# EAGLE design DSC-Supply (EAGLE 7.7.0)
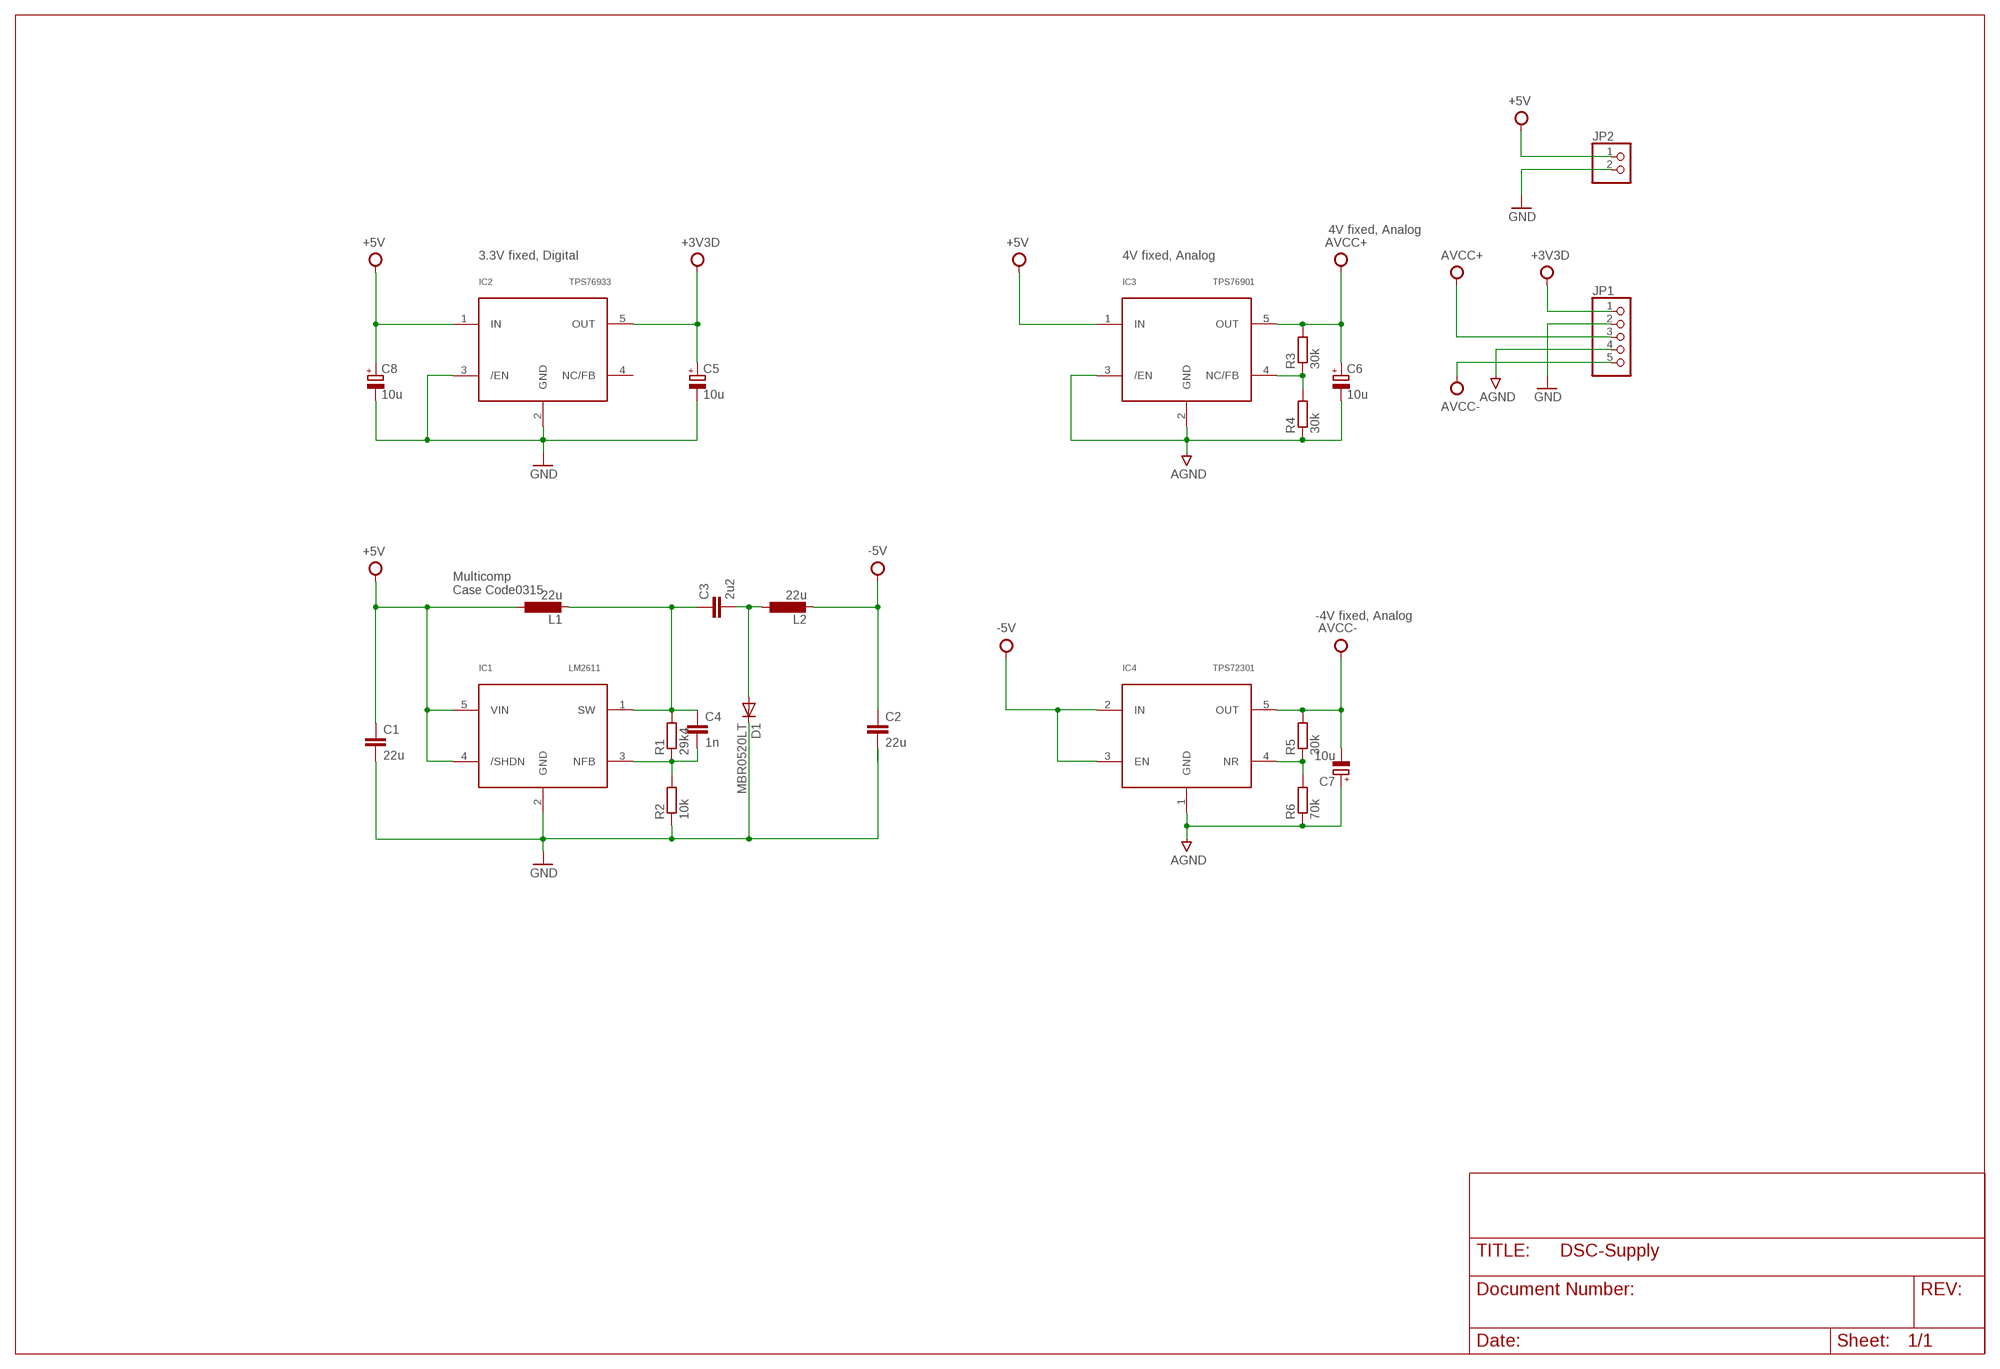
[diagram p0: schematic, sheet 1]

## Parts
C1  22u  C-EUC0805  [C0805]
C2  22u  C-EUC0805  [C0805]
C3  2u2  C-EUC0805  [C0805]
C4  1n  C-EUC0805  [C0805]
C5  10u  CPOL-EU153CLV-0405  [153CLV-0405]
C6  10u  CPOL-EU153CLV-0405  [153CLV-0405]
C7  10u  CPOL-EU153CLV-0405  [153CLV-0405]
C8  10u  CPOL-EU153CLV-0405  [153CLV-0405]
D1  MBR0520LT  [SOD123]
IC1  LM2611  [SOT23-DBV]
IC2  TPS76933  TPS769XX  [SOT23-DBV]
IC3  TPS76901  TPS769XX  [SOT23-DBV]
IC4  TPS72301  [SOT23-DBV]
JP1  PINHD-1X5  [1X05]
JP2  PINHD-1X2  [1X02]
L1  22u  L-EU  [L0315]
L2  22u  L-EU  [L0315]
R1  29k4  R-EU_R0805  [R0805]
R2  10k  R-EU_R0805  [R0805]
R3  30k  R-EU_R0805  [R0805]
R4  30k  R-EU_R0805  [R0805]
R5  30k  R-EU_R0805  [R0805]
R6  70k  R-EU_R0805  [R0805]

## Nets
+3V3D: C5.+ IC2.5(OUT) JP1.1
+5V: C1.1 C8.+ IC1.4(/SHDN) IC1.5(VIN) IC2.1(IN) IC3.1(IN) JP2.1 L1.1
-5V: C2.1 IC4.2(IN) IC4.3(EN) L2.2
AGND: C6.- C7.+ IC3.2(GND) IC3.3(/EN) IC4.1(GND) JP1.4 R4.1 R6.1
AVCC+: C6.+ IC3.5(OUT) JP1.3 R3.2
AVCC-: C7.- IC4.5(OUT) JP1.5 R5.2
GND: C1.2 C2.2 C5.- C8.- D1.C IC1.2(GND) IC2.2(GND) IC2.3(/EN) JP1.2 JP2.2 R2.1
N$2: C3.1 C4.1 IC1.1(SW) L1.2 R1.2
N$3: C4.2 IC1.3(NFB) R1.1 R2.2
N$4: IC3.4(NC/FB) R3.1 R4.2
N$6: IC4.4(NR) R5.1 R6.2
N$8: C3.2 D1.A L2.1
Unconnected: IC2.4(NC/FB)

## Notes on the sheet
- 4V fixed, Analog
- 3.3V fixed, Digital | 4V fixed, Analog
- Multicomp 
  Case Code0315
- -4V fixed, Analog

## Library data of the parts
C1-C4 = rcl-2:C-EU: CAPACITOR, European symbol
C5-C8 = rcl-2:CPOL-EU: POLARIZED CAPACITOR, European symbol
D1 = diode:MBR0520LT: SCHOTTKY BARRIER RECTIFIER Source: http://onsemi.com .. MBR0520LT1-D.pdf
IC1 = SupplySolutions:LM2611
IC2 IC3 = SupplySolutions:TPS769XX
IC4 = SupplySolutions:TPS72301
JP1 = pinhead:PINHD-1X5: PIN HEADER
JP2 = pinhead:PINHD-1X2: PIN HEADER
L1 L2 = sty_resistor:L-EU: INDUCTOR, European symbol
R1-R6 = rcl-2:R-EU_: RESISTOR, European symbol

## Board
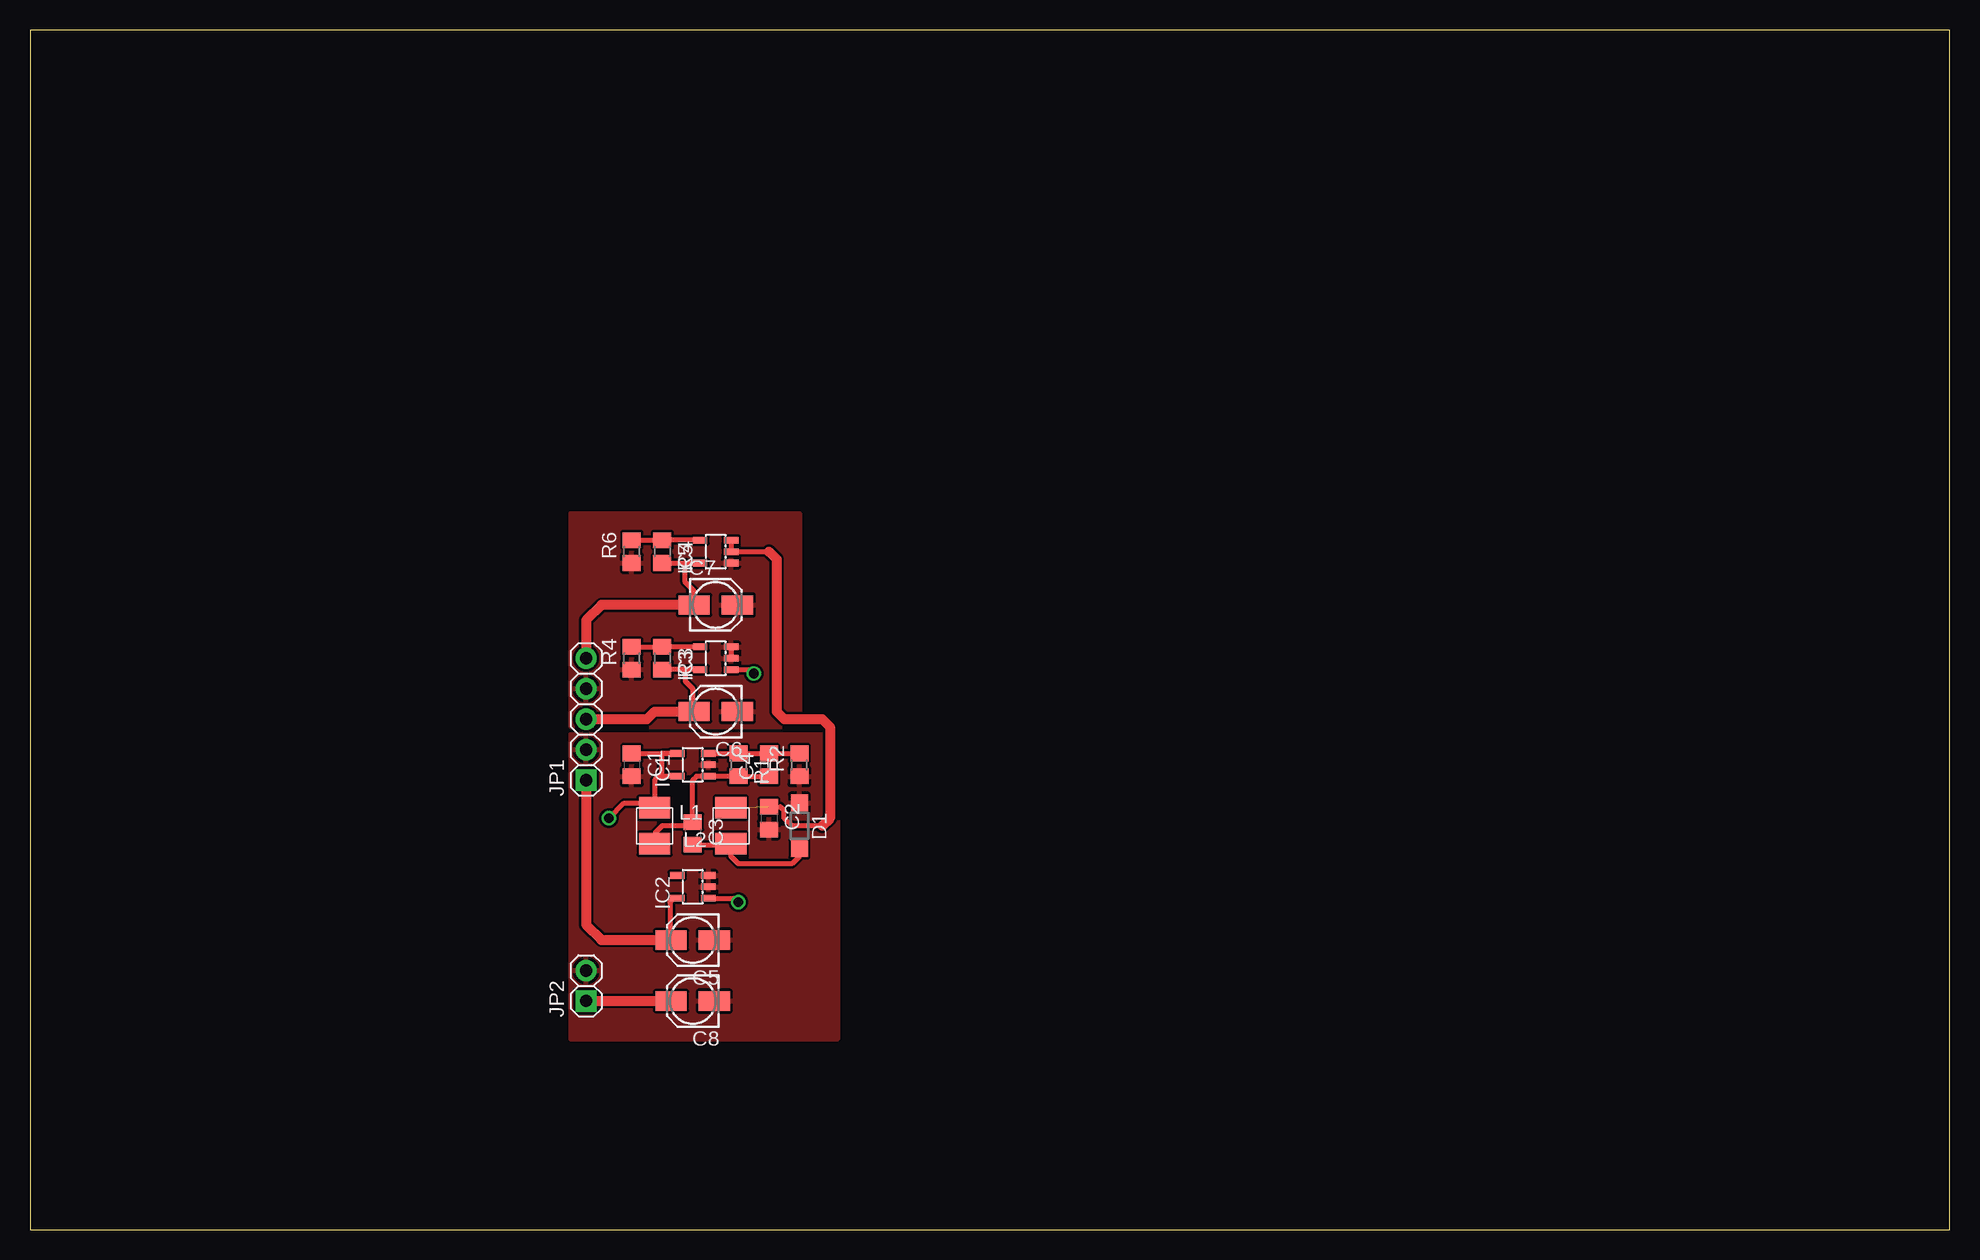
[diagram p1: board, top side]
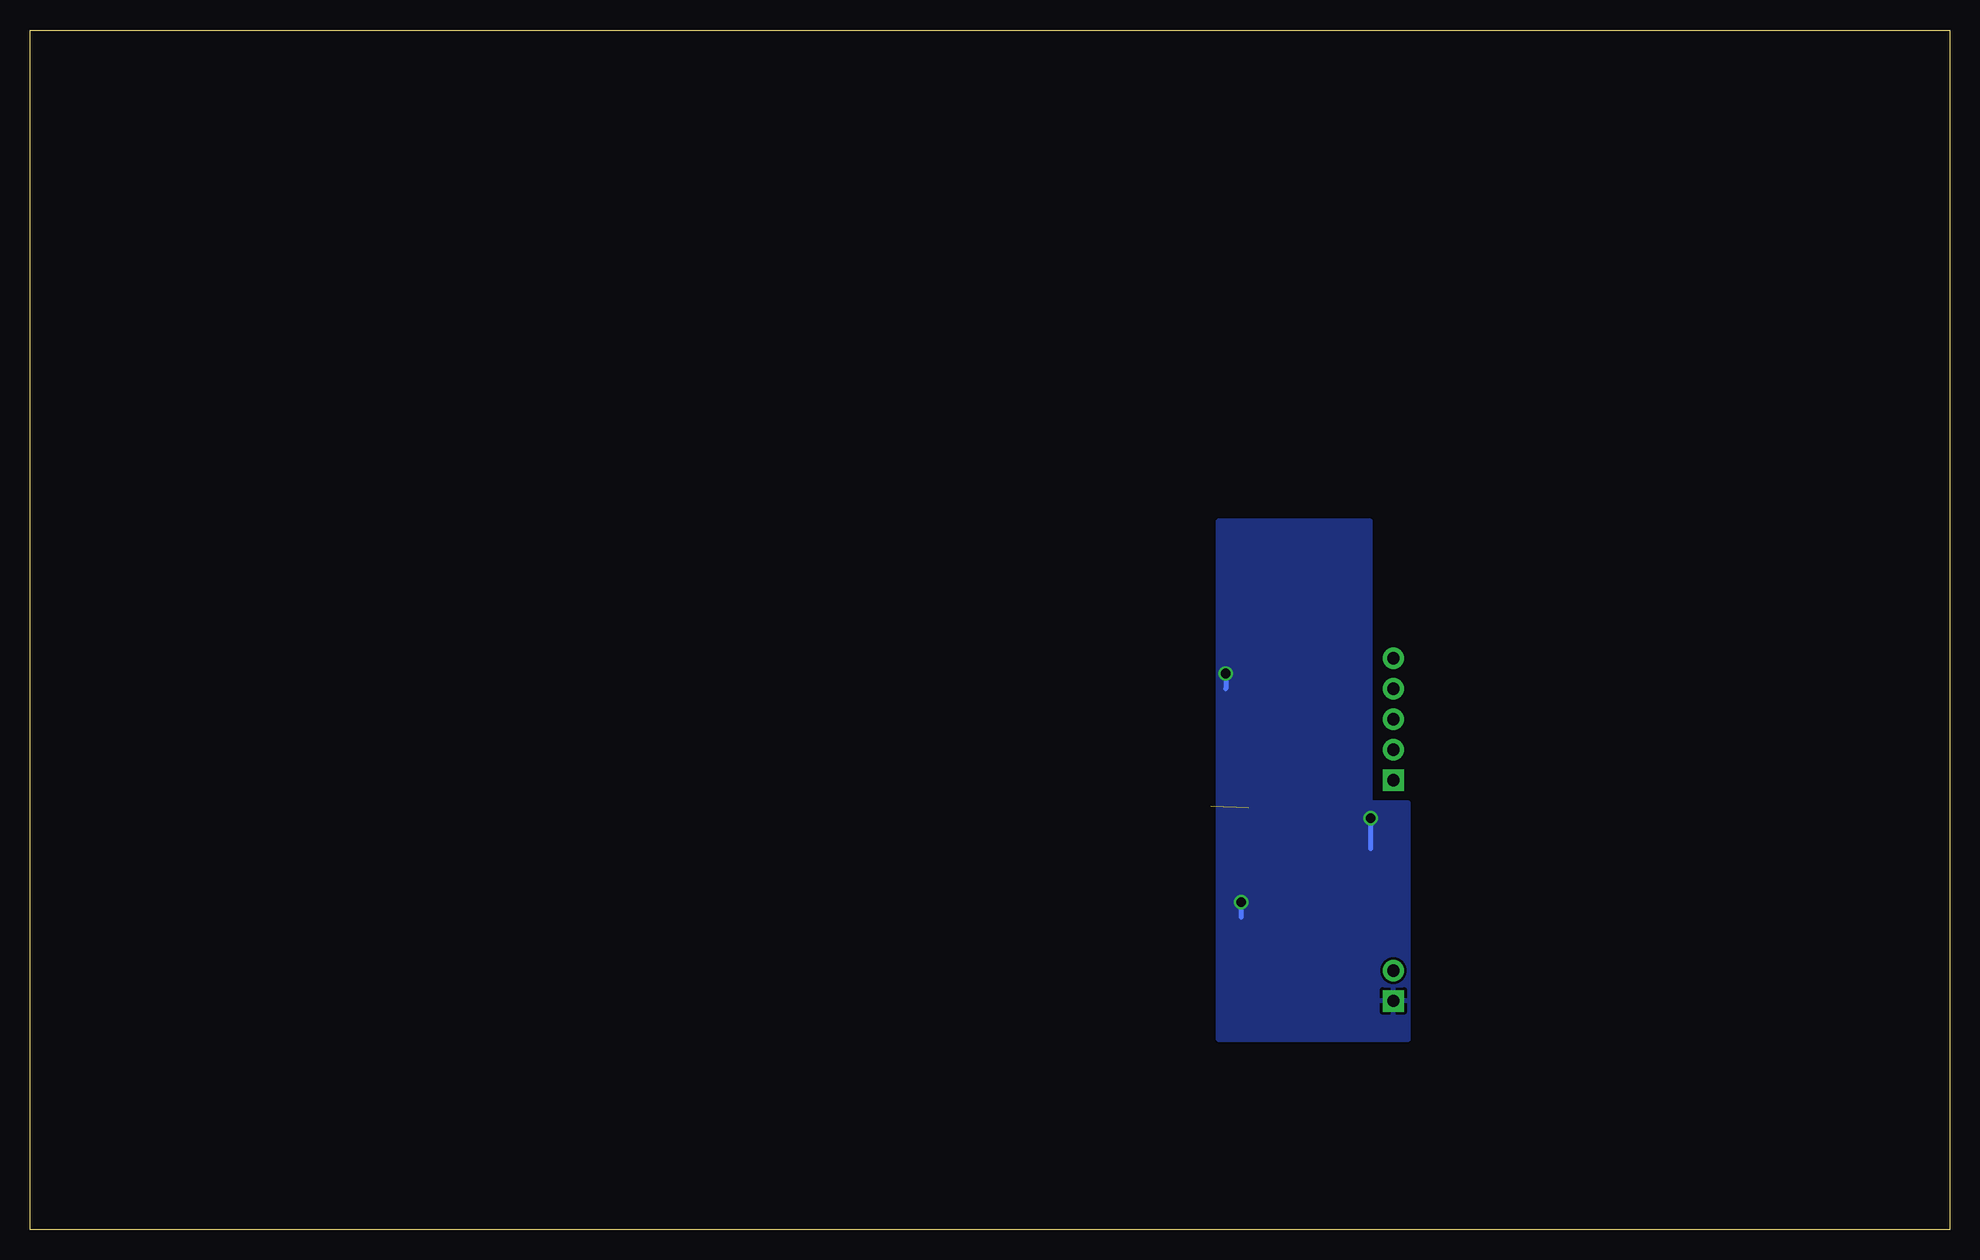
[diagram p2: board, bottom side, seen from below]

Size 160 x 100 mm. Coordinates in mm from the lower left corner, seen from the top.
Outline: 0,0 160,0 160,100 0,100 0,0
Copper layers (1*16): Top 0.035mm / dielectric 1.5mm / Bottom 0.035mm
Design rules "default": minimum track width 10mil, minimum drill 24mil, track to track 8mil, track to pad 8mil, pad to pad 8mil, via to via 8mil, smd to smd 8mil, copper to edge 40mil, drill to drill 8mil, minimum pad ring 10mil, minimum via ring 8mil, stop-mask expansion 4mil, vias tented up to drill 0mil, thermal gap 10mil

### Footprints (pad centres in the part's own frame; a part is rotated, then mirrored left to right if it is on the bottom)
C0805 = smd 1.3 x 1.5: 1 -0.95,0; 2 0.95,0
153CLV-0405 = smd 2.6 x 1.6: + 1.8,0; - -1.8,0
SOD123 = smd 1.4 x 1.4: A 1.9,0; C -1.9,0
SOT23-DBV = smd 0.55 x 1.2: 1 -0.95,-1.3; 2 0,-1.3; 3 0.95,-1.3; 4 0.95,1.3; 5 -0.95,1.3
1X05 = drill 1.016 pad 1.778 square: 1 -5.08,0 | drill 1.016 pad 1.778: 2 -2.54,0; 3 0,0; 4 2.54,0; 5 5.08,0
1X02 = drill 1.016 pad 1.778 square: 1 -1.27,0 | drill 1.016 pad 1.778: 2 1.27,0
L0315 = smd 2.6 x 1.8: 1 0,1.5; 2 0,-1.5
R0805 = smd 1.3 x 1.5: 1 -0.95,0; 2 0.95,0

### Placement (x,y rotation side)
C1  50.16,38.73 270 top
C2  61.59,34.29 270 top
C3  55.24,33.02 270 top
C4  61.59,38.73 90 top
C5  55.24,24.13 180 top
C6  57.15,43.18 180 top
C7  57.15,52.07 0 top
C8  55.24,19.05 180 top
D1  64.14,33.66 270 top
IC1  55.24,38.73 90 top
IC2  55.24,28.57 90 top
IC3  57.15,47.62 90 top
IC4  57.15,56.52 90 top
JP1  46.35,42.55 90 top
JP2  46.35,20.32 90 top
L1  52.07,33.66 0 top
L2  58.42,33.66 180 top
R1  59.05,38.73 270 top
R2  64.14,38.73 90 top
R3  52.7,47.62 270 top
R4  50.16,47.62 90 top
R5  52.7,56.52 270 top
R6  50.16,56.52 90 top

### Tracks (layer width: path | path; a pad name or v marks a point on that pad's centre or on a via)
+3V3D
  Top 0.406: IC2.5 53.66,27.62 53.34,27.3 53.34,24.23 C5.+
  Top 0.813: JP1.1 46.35,25.4 47.62,24.13 C5.+
+5V  (via drill 0.8)
  Top 0.406: C1.1 IC1.4 52.7,39.69 52.7,37.78 | IC1.5 52.7,37.78 | 52.7,37.78 52.39,37.78 52.07,37.47 L1.1 51.84,35.56 49.53,35.56 v48.26,34.29 | IC2.1 58.73,27.62 v59.05,27.3 | IC3.1 60.01,46.67 v60.33,46.35
  Top 0.813: JP2.1 C8.+
  Bottom 0.406: v59.05,27.3 59.05,26.04 | v48.26,34.29 48.26,31.75 | v60.33,46.35 60.33,45.09
  pour Bottom: 45.09,15.88 45.09,35.56 48.26,35.56 48.26,59.05 60.96,59.05 60.96,15.88
-5V  (1 unrouted)
  Top 0.406: 61.55,35.29 C2.1 62.55,35.24 62.87,34.92 62.87,34.29 63.5,33.66 66.04,33.66 | IC4.3 IC4.2 61.59,56.52
  Top 0.813: 61.59,56.52 62.23,55.88 62.23,43.18 62.87,42.55 66.04,42.55 66.67,41.91 66.67,34.29 66.04,33.66
AGND
  Top 0.406: IC3.3 IC3.2
  pour Top: 45.09,41.91 45.09,59.69 64.14,59.69 64.14,41.91
AVCC+
  Top 0.406: IC3.5 54.61,46.67 | 54.61,46.67 R3.2 | 54.61,43.18 C6.+ 55.24,43.28 55.24,45.09 54.61,45.72 54.61,46.67
  Top 0.813: JP1.3 51.44,42.55 52.07,43.18 C6.+
AVCC-
  Top 0.406: R5.2 54.61,55.56 | 54.61,55.56 IC4.5 | C7.- 55.35,53.23 54.61,53.98 54.61,55.56
  Top 0.813: C7.- 47.62,52.07 46.35,50.8 JP1.5
GND
  pour Top: 45.09,41.27 67.31,41.27 67.31,15.88 45.09,15.88
N$2
  Top 0.406: C4.1 R1.2 IC1.1 55.56,37.78 55.24,37.47 C3.1 55.24,33.66 52.7,33.66 52.07,33.02 L1.2
N$3
  Top 0.406: IC1.3 R1.1 C4.2 R2.2
N$4
  Top 0.406: R4.2 R3.1 IC3.4
N$6
  Top 0.406: IC4.4 R5.1 R6.2
N$8
  Top 0.406: C3.2 58.34,32.07 L2.1 58.42,31.11 59.05,30.48 63.5,30.48 64.14,31.11 D1.A